# EAGLE design Backplane (EAGLE 9.2.2)
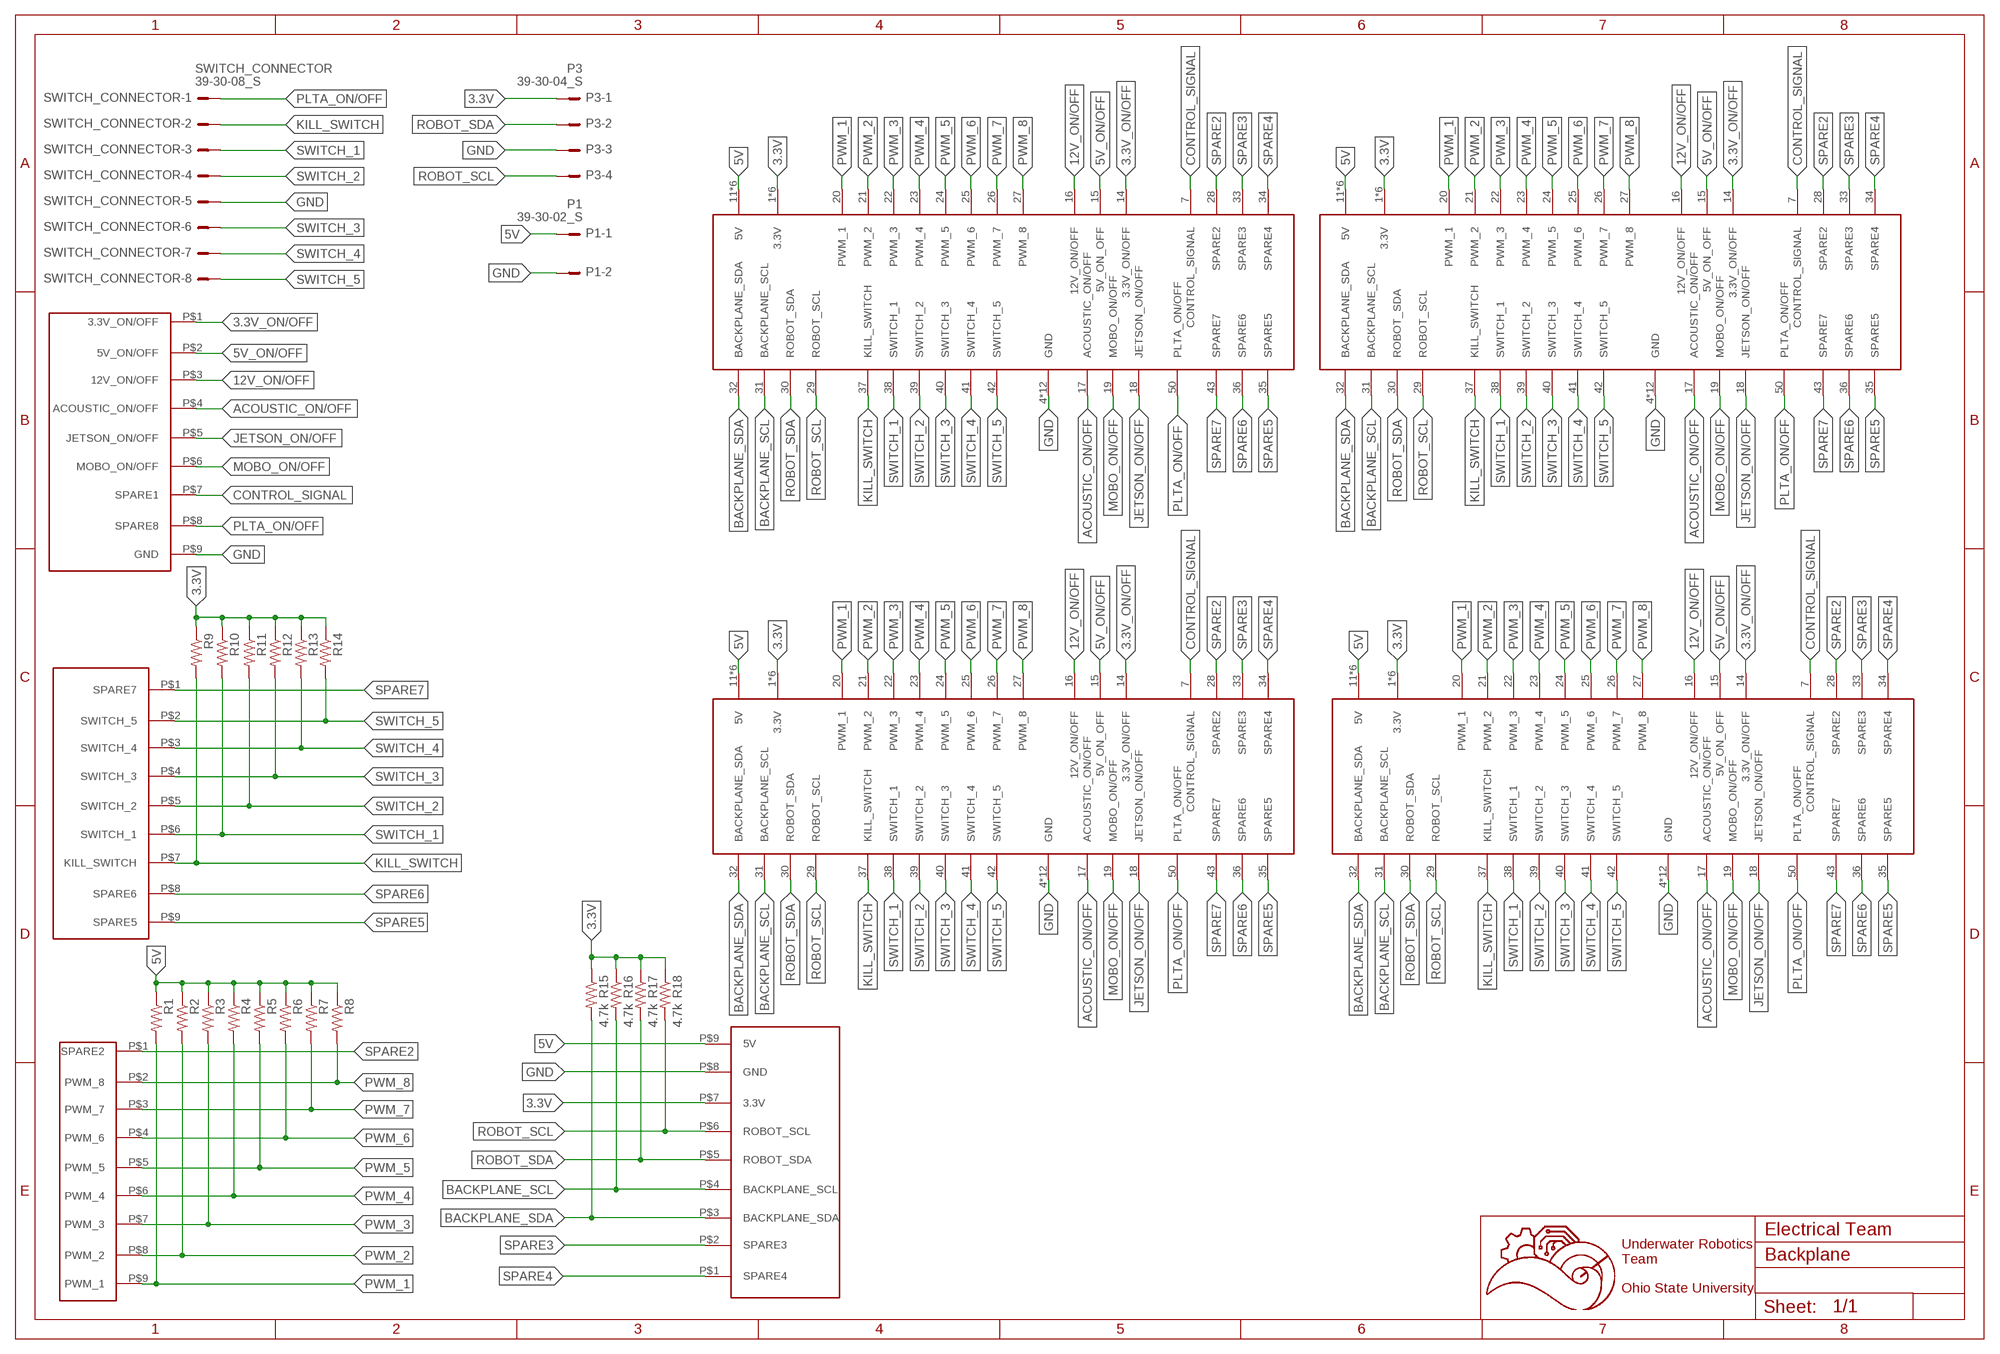
[diagram p0: schematic, sheet 1]

## Parts
P1  39-30-02_S  [39-30-?02?]
P3  39-30-04_S  [39-30-?04?]
R1  R-US_R0603  [R0603]
R2  R-US_R0603  [R0603]
R3  R-US_R0603  [R0603]
R4  R-US_R0603  [R0603]
R5  R-US_R0603  [R0603]
R6  R-US_R0603  [R0603]
R7  R-US_R0603  [R0603]
R8  R-US_R0603  [R0603]
R9  R-US_R0603  [R0603]
R10  R-US_R0603  [R0603]
R11  R-US_R0603  [R0603]
R12  R-US_R0603  [R0603]
R13  R-US_R0603  [R0603]
R14  R-US_R0603  [R0603]
R15  4.7k  R-US_R0603  [R0603]
R16  4.7k  R-US_R0603  [R0603]
R17  4.7k  R-US_R0603  [R0603]
R18  4.7k  R-US_R0603  [R0603]
SWITCH_CONNECTOR  39-30-08_S  [39-30-?08?]
U$1  5530843-FEMALE  [5530843-6-BACKPLANEMATE]
U$2  5530843-FEMALE  [5530843-6-BACKPLANEMATE]
U$3  5530843-FEMALE  [5530843-6-BACKPLANEMATE]
U$4  5530843-FEMALE  [5530843-6-BACKPLANEMATE]
U$5  929870-01-09_1  [929852-01-09_1ROW]
U$6  929870-01-09_2  [929852-01-09_1ROW]
U$7  929870-01-09_3  [929852-01-09_1ROW]
U$8  929870-01-09_4  [929852-01-09_1ROW]

## Nets
3.3V: P3.1 R9.1 R10.1 R11.1 R12.1 R13.1 R14.1 R15.1 R16.1 R17.1 R18.1 U$1.1(3.3V) U$1.2(3.3V) U$1.3(3.3V) U$1.54(3.3V) U$1.55(3.3V) U$1.56(3.3V) U$2.1(3.3V) U$2.2(3.3V) U$2.3(3.3V) U$2.54(3.3V) U$2.55(3.3V) U$2.56(3.3V) U$3.1(3.3V) U$3.2(3.3V) U$3.3(3.3V) U$3.54(3.3V) U$3.55(3.3V) U$3.56(3.3V) U$4.1(3.3V) U$4.2(3.3V) U$4.3(3.3V) U$4.54(3.3V) U$4.55(3.3V) U$4.56(3.3V) U$8.P$7(3.3V)
3.3V_ON/OFF: U$1.14(3.3V_ON/OFF) U$2.14(3.3V_ON/OFF) U$3.14(3.3V_ON/OFF) U$4.14(3.3V_ON/OFF) U$7.P$1(3.3V_ON/OFF)
5V: P1.1 R1.1 R2.1 R3.1 R4.1 R5.1 R6.1 R7.1 R8.1 U$1.11(5V) U$1.12(5V) U$1.13(5V) U$1.44(5V) U$1.45(5V) U$1.46(5V) U$2.11(5V) U$2.12(5V) U$2.13(5V) U$2.44(5V) U$2.45(5V) U$2.46(5V) U$3.11(5V) U$3.12(5V) U$3.13(5V) U$3.44(5V) U$3.45(5V) U$3.46(5V) U$4.11(5V) U$4.12(5V) U$4.13(5V) U$4.44(5V) U$4.45(5V) U$4.46(5V) U$8.P$9(5V)
5V_ON/OFF: U$1.15(5V_ON_OFF) U$2.15(5V_ON_OFF) U$3.15(5V_ON_OFF) U$4.15(5V_ON_OFF) U$7.P$2(5V_ON/OFF)
12V_ON/OFF: U$1.16(12V_ON/OFF) U$2.16(12V_ON/OFF) U$3.16(12V_ON/OFF) U$4.16(12V_ON/OFF) U$7.P$3(12V_ON/OFF)
ACOUSTIC_ON/OFF: U$1.17(ACOUSTIC_ON/OFF) U$2.17(ACOUSTIC_ON/OFF) U$3.17(ACOUSTIC_ON/OFF) U$4.17(ACOUSTIC_ON/OFF) U$7.P$4(ACOUSTIC_ON/OFF)
BACKPLANE_SCL: R16.2 U$1.31(BACKPLANE_SCL) U$2.31(BACKPLANE_SCL) U$3.31(BACKPLANE_SCL) U$4.31(BACKPLANE_SCL) U$8.P$4(BACKPLANE_SCL)
BACKPLANE_SDA: R15.2 U$1.32(BACKPLANE_SDA) U$2.32(BACKPLANE_SDA) U$3.32(BACKPLANE_SDA) U$4.32(BACKPLANE_SDA) U$8.P$3(BACKPLANE_SDA)
CONTROL_SIGNAL: U$1.7(CONTROL_SIGNAL) U$2.7(CONTROL_SIGNAL) U$3.7(CONTROL_SIGNAL) U$4.7(CONTROL_SIGNAL) U$7.P$7(SPARE1)
GND: P1.2 P3.3 SWITCH_CONNECTOR.5 U$1.4(GND) U$1.5(GND) U$1.6(GND) U$1.8(GND) U$1.9(GND) U$1.10(GND) U$1.47(GND) U$1.48(GND) U$1.49(GND) U$1.51(GND) U$1.52(GND) U$1.53(GND) U$2.4(GND) U$2.5(GND) U$2.6(GND) U$2.8(GND) U$2.9(GND) U$2.10(GND) U$2.47(GND) U$2.48(GND) U$2.49(GND) U$2.51(GND) U$2.52(GND) U$2.53(GND) U$3.4(GND) U$3.5(GND) U$3.6(GND) U$3.8(GND) U$3.9(GND) U$3.10(GND) U$3.47(GND) U$3.48(GND) U$3.49(GND) U$3.51(GND) U$3.52(GND) U$3.53(GND) U$4.4(GND) U$4.5(GND) U$4.6(GND) U$4.8(GND) U$4.9(GND) U$4.10(GND) U$4.47(GND) U$4.48(GND) U$4.49(GND) U$4.51(GND) U$4.52(GND) U$4.53(GND) U$7.P$9(GND) U$8.P$8(GND)
JETSON_ON/OFF: U$1.18(JETSON_ON/OFF) U$2.18(JETSON_ON/OFF) U$3.18(JETSON_ON/OFF) U$4.18(JETSON_ON/OFF) U$7.P$5(JETSON_ON/OFF)
KILL_SWITCH: R9.2 SWITCH_CONNECTOR.2 U$1.37(KILL_SWITCH) U$2.37(KILL_SWITCH) U$3.37(KILL_SWITCH) U$4.37(KILL_SWITCH) U$5.P$7(KILL_SWITCH)
MOBO_ON/OFF: U$1.19(MOBO_ON/OFF) U$2.19(MOBO_ON/OFF) U$3.19(MOBO_ON/OFF) U$4.19(MOBO_ON/OFF) U$7.P$6(MOBO_ON/OFF)
PLTA_ON/OFF: SWITCH_CONNECTOR.1 U$1.50(PLTA_ON/OFF) U$2.50(PLTA_ON/OFF) U$3.50(PLTA_ON/OFF) U$4.50(PLTA_ON/OFF) U$7.P$8(SPARE8)
PWM_1: R1.2 U$1.20(PWM_1) U$2.20(PWM_1) U$3.20(PWM_1) U$4.20(PWM_1) U$6.P$9(PWM_1)
PWM_2: R2.2 U$1.21(PWM_2) U$2.21(PWM_2) U$3.21(PWM_2) U$4.21(PWM_2) U$6.P$8(PWM_2)
PWM_3: R3.2 U$1.22(PWM_3) U$2.22(PWM_3) U$3.22(PWM_3) U$4.22(PWM_3) U$6.P$7(PWM_3)
PWM_4: R4.2 U$1.23(PWM_4) U$2.23(PWM_4) U$3.23(PWM_4) U$4.23(PWM_4) U$6.P$6(PWM_4)
PWM_5: R5.2 U$1.24(PWM_5) U$2.24(PWM_5) U$3.24(PWM_5) U$4.24(PWM_5) U$6.P$5(PWM_5)
PWM_6: R6.2 U$1.25(PWM_6) U$2.25(PWM_6) U$3.25(PWM_6) U$4.25(PWM_6) U$6.P$4(PWM_6)
PWM_7: R7.2 U$1.26(PWM_7) U$2.26(PWM_7) U$3.26(PWM_7) U$4.26(PWM_7) U$6.P$3(PWM_7)
PWM_8: R8.2 U$1.27(PWM_8) U$2.27(PWM_8) U$3.27(PWM_8) U$4.27(PWM_8) U$6.P$2(PWM_8)
ROBOT_SCL: P3.4 R18.2 U$1.29(ROBOT_SCL) U$2.29(ROBOT_SCL) U$3.29(ROBOT_SCL) U$4.29(ROBOT_SCL) U$8.P$6(ROBOT_SCL)
ROBOT_SDA: P3.2 R17.2 U$1.30(ROBOT_SDA) U$2.30(ROBOT_SDA) U$3.30(ROBOT_SDA) U$4.30(ROBOT_SDA) U$8.P$5(ROBOT_SDA)
SPARE2: U$1.28(SPARE2) U$2.28(SPARE2) U$3.28(SPARE2) U$4.28(SPARE2) U$6.P$1(SPARE2)
SPARE3: U$1.33(SPARE3) U$2.33(SPARE3) U$3.33(SPARE3) U$4.33(SPARE3) U$8.P$2(SPARE3)
SPARE4: U$1.34(SPARE4) U$2.34(SPARE4) U$3.34(SPARE4) U$4.34(SPARE4) U$8.P$1(SPARE4)
SPARE5: U$1.35(SPARE5) U$2.35(SPARE5) U$3.35(SPARE5) U$4.35(SPARE5) U$5.P$9(SPARE5)
SPARE6: U$1.36(SPARE6) U$2.36(SPARE6) U$3.36(SPARE6) U$4.36(SPARE6) U$5.P$8(SPARE6)
SPARE7: U$1.43(SPARE7) U$2.43(SPARE7) U$3.43(SPARE7) U$4.43(SPARE7) U$5.P$1(SPARE7)
SWITCH_1: R10.2 SWITCH_CONNECTOR.3 U$1.38(SWITCH_1) U$2.38(SWITCH_1) U$3.38(SWITCH_1) U$4.38(SWITCH_1) U$5.P$6(SWITCH_1)
SWITCH_2: R11.2 SWITCH_CONNECTOR.4 U$1.39(SWITCH_2) U$2.39(SWITCH_2) U$3.39(SWITCH_2) U$4.39(SWITCH_2) U$5.P$5(SWITCH_2)
SWITCH_3: R12.2 SWITCH_CONNECTOR.6 U$1.40(SWITCH_3) U$2.40(SWITCH_3) U$3.40(SWITCH_3) U$4.40(SWITCH_3) U$5.P$4(SWITCH_3)
SWITCH_4: R13.2 SWITCH_CONNECTOR.7 U$1.41(SWITCH_4) U$2.41(SWITCH_4) U$3.41(SWITCH_4) U$4.41(SWITCH_4) U$5.P$3(SWITCH_4)
SWITCH_5: R14.2 SWITCH_CONNECTOR.8 U$1.42(SWITCH_5) U$2.42(SWITCH_5) U$3.42(SWITCH_5) U$4.42(SWITCH_5) U$5.P$2(SWITCH_5)

## Notes on the sheet
- Electrical Team
- Underwater Robotics
  Team
  
  Ohio State University

## Library data of the parts
P1 = con-molex-mini-fit:39-30-?02?_S: HEADER
P3 = con-molex-mini-fit:39-30-?04?_S: HEADER
R1-R18 = rcl:R-US_: RESISTOR, American symbol; SPICEPREFIX: R
SWITCH_CONNECTOR = con-molex-mini-fit:39-30-?08?_S: HEADER
U$1-U$4 = 5530843-6:5530843-FEMALE
U$5 = 3M_929852_Connector:929870-01-09_1
U$6 = 3M_929852_Connector:929870-01-09_2
U$7 = 3M_929852_Connector:929870-01-09_3
U$8 = 3M_929852_Connector:929870-01-09_4

## Board
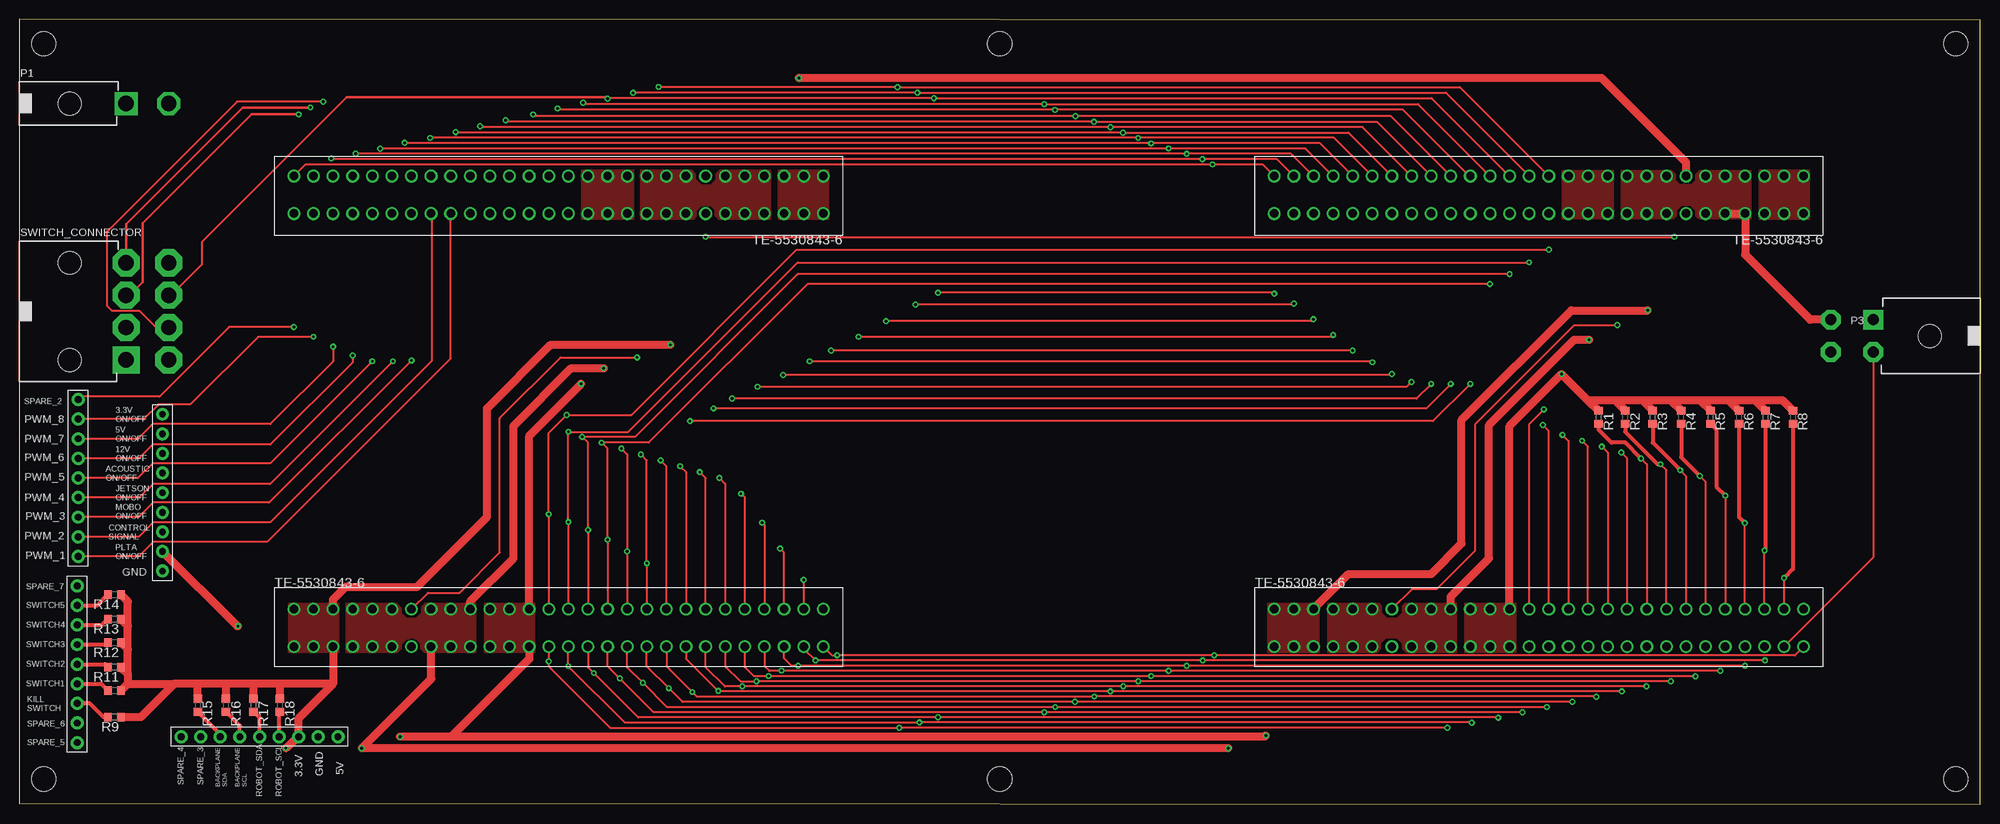
[diagram p1: board, top side]
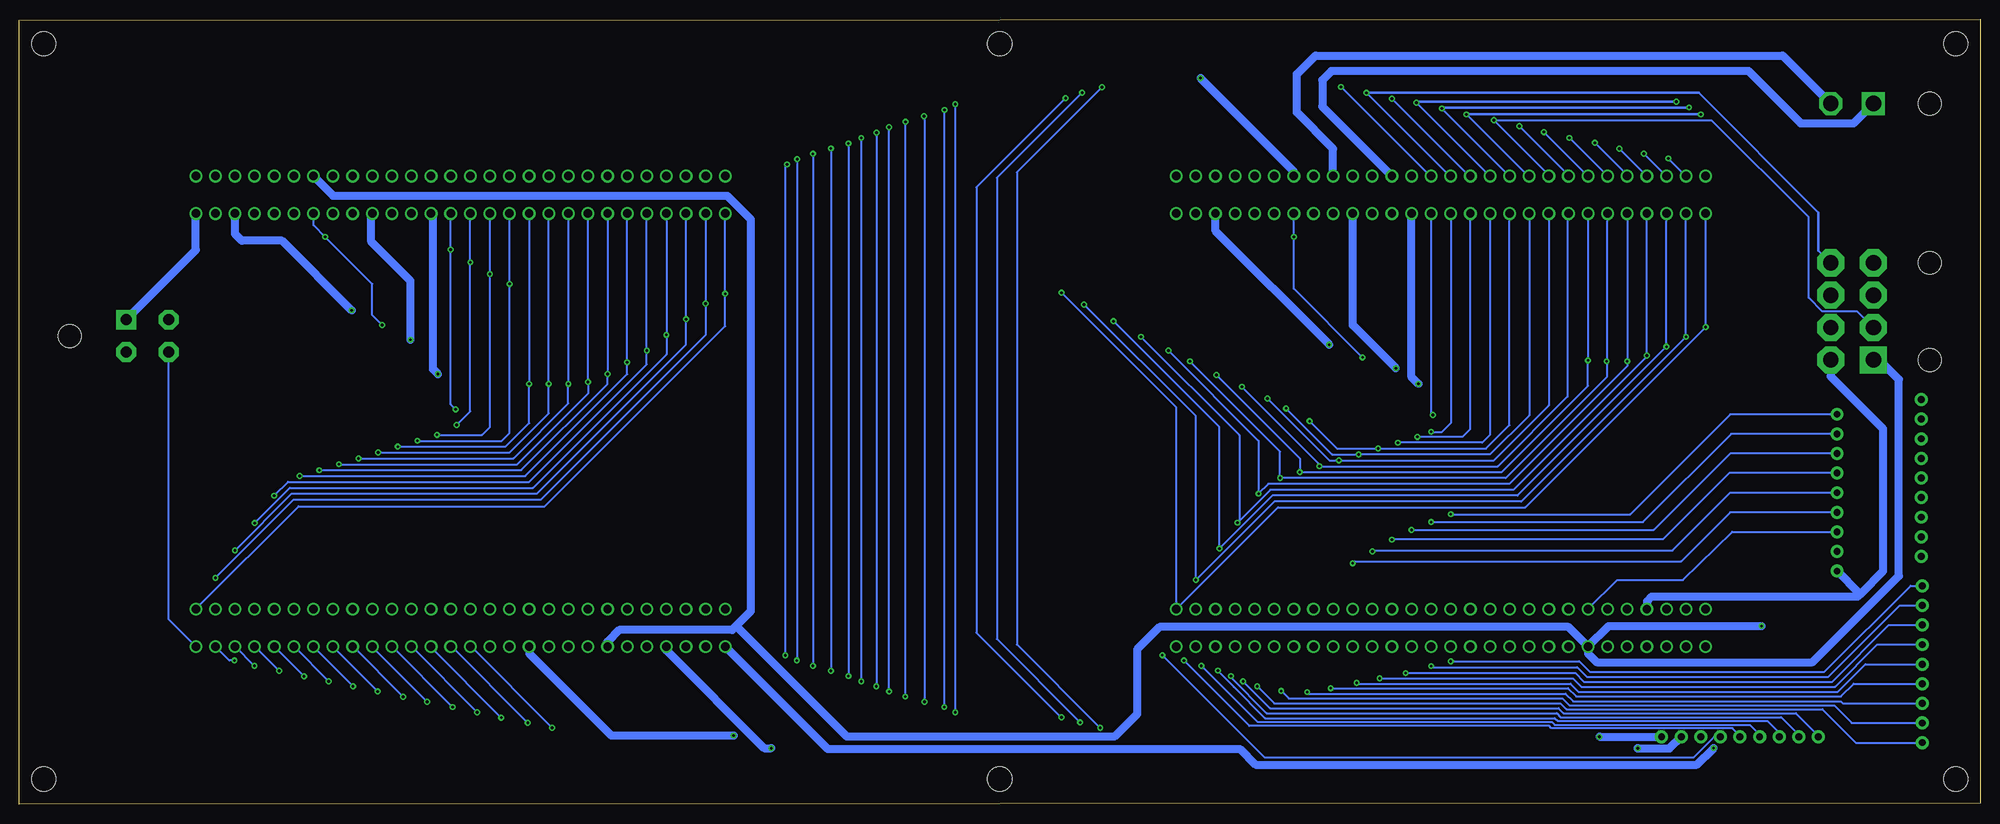
[diagram p2: board, bottom side, seen from below]

Size 254 x 101.73 mm. Coordinates in mm from the lower left corner, seen from the top.
Outline: 0,0.13 254,0 254,101.6 0,101.73 0,0.13
Copper layers (1*16): Top 0.035mm / dielectric 1.5mm / Bottom 0.035mm
Design rules "default": minimum track width 6mil, minimum drill 0.35mm, track to track 6mil, track to pad 6mil, pad to pad 6mil, via to via 6mil, smd to smd 6mil, copper to edge 40mil, drill to drill 6mil, minimum pad ring 10mil, minimum via ring 8mil, stop-mask expansion 4mil, vias tented up to drill 0mil, thermal gap 10mil
Holes 3.17 mm at 3.17,98.55 3.17,3.3 250.82,3.3 250.82,98.55 127,3.3 127,98.55

### Footprints (pad centres in the part's own frame; a part is rotated, then mirrored left to right if it is on the bottom)
39-30-?02? = drill 2 pad 3 square: 1 0,0 | drill 2 pad 3 octagon: 2 0,5.512 | hole 3: 0,-7.3
39-30-?04? = drill 1.422 pad 2.54 square: 1 2.095,0 | drill 1.422 pad 2.54 octagon: 2 -2.095,0; 3 2.095,5.512; 4 -2.095,5.512 | hole 3: 0,-7.3
R0603 = smd 1 x 1.1: 1 -0.85,0; 2 0.85,0
39-30-?08? = drill 2 pad 3.5 square: 1 6.287,0 | drill 2 pad 3.5 octagon: 2 2.095,0; 3 -2.095,0; 4 -6.287,0; 5 6.287,5.512; 6 2.095,5.512; 7 -2.095,5.512; 8 -6.287,5.512 | hole 3: -6.287,-7.3; 6.287,-7.3
5530843-6-BACKPLANEMATE = drill 1.092: 1 0,4.851; 2 2.54,4.851; 3 5.08,4.851; 4 7.62,4.851; 5 10.16,4.851; 6 12.7,4.851; 7 15.24,4.851; 8 17.78,4.851; 9 20.32,4.851; 10 22.86,4.851; 11 25.4,4.851; 12 27.94,4.851; 13 30.48,4.851; 14 33.02,4.851; 15 35.56,4.851; 16 38.1,4.851; 17 40.64,4.851; 18 43.18,4.851; 19 45.72,4.851; 20 48.26,4.851; 21 50.8,4.851; 22 53.34,4.851; 23 55.88,4.851; 24 58.42,4.851; 25 60.96,4.851; 26 63.5,4.851; 27 66.04,4.851; 28 68.58,4.851; 29 68.58,0; 30 66.04,0; 31 63.5,0; 32 60.96,0; 33 58.42,0; 34 55.88,0; 35 53.34,0; 36 50.8,0; 37 48.26,0; 38 45.72,0; 39 43.18,0; 40 40.64,0; 41 38.1,0; 42 35.56,0; 43 33.02,0; 44 30.48,0; 45 27.94,0; 46 25.4,0; 47 22.86,0; 48 20.32,0; 49 17.78,0; 50 15.24,0; 51 12.7,0; 52 10.16,0; 53 7.62,0; 54 5.08,0; 55 2.54,0; 56 0,0
929852-01-09_1ROW = drill 0.889 pad 1.676: P$1 1.27,1.27; P$2 3.81,1.27; P$3 6.35,1.27; P$4 8.89,1.27; P$5 11.43,1.27; P$6 13.97,1.27; P$7 16.51,1.27; P$8 19.05,1.27; P$9 21.59,1.27

### Placement (x,y rotation side)
P1  39-30-02?_S  [39-30-?02?]  13.84,90.8 270 top
P3  39-30-04?_S  [39-30-?04?]  240.16,60.71 90 top
R1  10k  [R0603]  204.6,50.16 270 top
R2  10k  [R0603]  208.03,50.16 270 top
R3  10k  [R0603]  211.58,50.16 270 top
R4  10k  [R0603]  215.26,50.16 270 top
R5  10k  [R0603]  219.07,50.16 270 top
R6  10k  [R0603]  222.76,50.16 270 top
R7  10k  [R0603]  226.19,50.16 270 top
R8  10k  [R0603]  229.74,50.16 270 top
R9  10k  [R0603]  12.32,11.3 180 top
R10  10k  [R0603]  12.32,14.73 180 top
R11  10k  [R0603]  12.32,17.78 180 top
R12  10k  [R0603]  12.32,20.95 180 top
R13  10k  [R0603]  12.32,24 180 top
R14  10k  [R0603]  12.32,27.18 180 top
R15  23.11,12.83 270 top
R16  26.8,12.83 270 top
R17  30.35,12.83 270 top
R18  33.78,12.83 270 top
SWITCH_CONNECTOR  39-30-08?_S  [39-30-?08?]  13.84,63.88 270 top
U$1  104.14,81.41 180 top
U$2  231.14,81.41 180 top
U$3  35.56,20.45 0 top
U$4  162.56,20.45 0 top
U$5  6.22,29.59 270 top
U$6  6.35,53.72 270 top
U$7  17.27,51.82 270 top
U$8  19.68,7.49 0 top

### Tracks (layer width: path | path; a pad name or v marks a point on that pad's centre or on a via)
3.3V  (via drill 0.35)
  Top 1.016: U$3.54 40.64,15.62 | 40.64,15.62 36.2,11.18 U$8.P$7 36.2,8.64 35.9,8.64 34.55,7.29 v34.52,7.29 | U$4.3 172.19,29.84 182.88,29.84 186.82,33.78 186.82,49.78 201.04,64.01 v210.95,64.01 | U$3.3 40.64,26.54 42.29,28.19 51.56,28.19 60.58,37.21 60.58,51.31 68.83,59.56 v84.33,59.56 | 40.64,15.62 33.91,15.62 | 33.91,15.62 30.35,15.62 | 30.35,15.62 26.8,15.62 | 26.8,15.62 23.11,15.62 | 23.11,15.62 20.07,15.62 | 20.07,15.62 15.75,11.3 R9.1 | R15.1 23.11,15.62 | R16.1 26.8,15.62 | R17.1 30.35,15.62 | R18.1 33.78,15.49 33.91,15.62 | R10.1 14.06,15.62 | 14.06,15.62 20.07,15.62 | R11.1 14.06,16.89 | 14.06,16.89 14.06,15.62 | 14.06,16.89 14.06,20.07 | 14.06,20.07 R12.1 | 14.06,20.07 14.06,23.11 | 14.06,23.11 R13.1 | 14.06,23.11 14.06,26.29 R14.1
  Bottom 1.016: P3.1 231.1,71.86 231.14,71.86 U$2.1 | U$4.56 149.3,7.19 95.91,7.19 93.85,5.13 36.68,5.13 v34.52,7.29 | v210.95,64.01 219.96,73.02 225.17,73.02 226.06,73.91 U$2.3 | v84.33,59.56 99.06,74.3 U$1.3
  pour Top (no thermals): 34.8,26.04 34.8,19.68 41.4,19.68 41.4,26.04
  pour Top (no thermals): 98.3,82.17 98.3,75.82 104.9,75.82 104.9,82.17
  pour Top (no thermals): 225.3,82.17 225.3,75.82 231.9,75.82 231.9,82.17
  pour Top (no thermals): 161.67,26.04 161.67,19.68 168.4,19.68 168.4,26.04
3.3V_ON/OFF  (via drill 0.35)
  Top 0.254: U$3.14 v68.58,37.59 68.58,48.13 v70.9,50.45 79.28,50.45 100.71,71.88 v198.12,71.88 | U$4.14 195.58,49.28 v197.49,51.18
  Bottom 0.254: v68.58,37.59 45.34,37.59 32.38,50.55 U$7.P$1 | v70.9,50.45 71.12,50.67 U$1.14 | v197.49,51.18 198.12,51.82 v198.12,71.88 U$2.14
5V  (via drill 0.35)
  Top 1.016: U$3.44 66.04,18.85 55.96,8.76 | v161.47,8.92 161.31,8.76 55.96,8.76 | 55.96,8.76 v49.33,8.76 | U$4.13 193.04,49.02 v199.77,55.75 203.14,52.39 | U$3.13 66.04,47.75 v72.77,54.48 | 203.14,52.39 204.51,51.02 R1.1 | 203.14,52.39 206.65,52.39 | 206.65,52.39 R2.1 | 206.65,52.39 210.21,52.39 | 210.21,52.39 R3.1 | 210.21,52.39 213.89,52.39 | 213.89,52.39 R4.1 | 213.89,52.39 217.7,52.39 | 217.7,52.39 R5.1 | 217.7,52.39 221.39,52.39 | 221.39,52.39 R6.1 | 221.39,52.39 224.81,52.39 | 224.81,52.39 R7.1 | 224.81,52.39 228.37,52.39 R8.1
  Bottom 1.016: U$4.46 187.96,19.56 177.32,8.92 v161.47,8.92 | v199.77,55.75 200.41,56.39 200.41,76.3 U$2.13 | v72.77,54.48 73.66,55.37 U$1.13 | v49.33,8.76 U$8.P$9 | U$1.45 85.22,90.42 85.22,93.85 84.05,95.02 30,95.02 23.24,88.27 16.38,88.27 P1.1
  pour Top (no thermals): 60.2,26.04 60.2,19.68 66.8,19.68 66.8,26.04
  pour Top (no thermals): 72.77,82.17 72.77,75.82 79.63,75.82 79.63,82.17
  pour Top (no thermals): 206.5,82.17 206.5,75.82 199.9,75.82 199.9,82.17
  pour Top (no thermals): 187.2,26.04 187.2,19.68 193.93,19.68 193.93,26.04
5V_ON/OFF  (via drill 0.35)
  Top 0.254: U$3.15 v71.12,36.58 v71.12,48.28 78.89,48.28 100.84,70.23 v195.58,70.23 | U$4.15 198.12,48.39 v197.36,49.15
  Bottom 0.254: v71.12,48.28 69.7,48.28 68.58,49.4 U$1.15 | v197.36,49.15 195.58,50.93 v195.58,70.23 U$2.15 | U$7.P$2 32.26,48.01 43.69,36.58 v71.12,36.58
12V_ON/OFF  (via drill 0.35)
  Top 0.254: v199.9,47.88 200.66,47.12 U$4.16 | v193.04,68.71 100.84,68.71 79.76,47.62 v72.9,47.62 73.66,46.86 v73.66,35.56 U$3.16
  Bottom 0.254: v199.9,47.88 194.06,47.88 193.04,48.9 v193.04,68.71 U$2.16 | v72.9,47.62 67.06,47.62 66.04,48.64 U$1.16 | U$7.P$3 32.38,45.47 42.29,35.56 v73.66,35.56
ACOUSTIC_ON/OFF  (via drill 0.35)
  Top 0.254: v202.44,47.12 203.2,46.36 U$4.17 | v190.5,67.44 102.11,67.44 81.53,46.86 v75.44,46.86 76.2,46.1 v76.2,34.29 U$3.17
  Bottom 0.254: v202.44,47.12 191.52,47.12 190.5,48.13 v190.5,67.44 U$2.17 | v75.44,46.86 64.52,46.86 63.5,47.88 U$1.17 | v76.2,34.29 76.07,34.42 41.02,34.42 32.51,42.93 U$7.P$4
BACKPLANE_SCL  (via drill 0.35)
  Top 0.254: U$3.31 99.06,18.92 100.03,17.96 v100.89,17.96 151.16,17.96 v151.21,17.96 151.26,17.96 v223.54,17.96 | U$2.31 164.74,84.3 v151.21,84.3 43.59,84.3 v43.56,84.33
  Top 0.508: U$8.P$4 28.57,10.2 R16.2
  Bottom 0.254: U$4.31 226.03,20.45 v223.54,17.96 | v43.56,84.33 U$1.31 | v151.21,84.3 v151.21,17.96 | v100.89,17.96 93.6,10.67 55.5,10.67 55.12,10.29 29.84,10.29 28.57,9.02 U$8.P$4
BACKPLANE_SDA  (via drill 0.35)
  Top 0.254: U$3.32 96.52,17.91 97.16,17.27 98.68,17.27 v98.73,17.32 98.75,17.3 v148.87,17.3 v220.34,17.3 | U$2.32 166.6,84.99 v148.87,84.99 46.76,84.99 v46.74,84.96
  Top 0.508: U$8.P$3 26.04,9.06 R15.2
  Bottom 0.254: U$4.32 223.5,20.45 v220.34,17.3 | v46.74,84.96 U$1.32 | v148.87,84.99 v148.87,17.3 | v98.73,17.32 98.73,17.28 96.67,15.22 92.63,11.18 55.12,11.18 54.74,10.79 27.56,10.79 26.04,9.27 U$8.P$3
CONTROL_SIGNAL  (via drill 0.35)
  Top 0.254: U$4.7 180.44,27.94 183.64,27.94 188.59,32.89 188.59,49.28 201.42,62.1 v207.01,62.1 | U$3.7 52.93,27.43 57.02,27.43 62.23,32.64 62.23,50.04 70.1,57.91 v80.01,57.91 | v88.9,73.53 v214.38,73.53
  Bottom 0.254: U$7.P$7 32.13,35.31 38.51,29.08 47.02,29.08 U$3.7 | v207.01,62.1 208.28,63.37 208.28,67.44 v214.38,73.53 215.9,75.06 U$2.7 | v80.01,57.91 88.9,66.8 v88.9,73.53 U$1.7
GND  (via drill 0.35)
  Top 0.254: 214.12,76.58 214.1,76.56
  Top 1.016: P3.3 231.98,62.8 223.57,71.21 223.57,76.5 U$2.4 U$2.5 | v156.59,7.26 v44.35,7.26 53.37,16.28 53.37,20.42 U$3.49 | U$4.10 185.42,26.92 190.37,31.88 190.37,49.15 201.42,60.2 v203.33,60.2 | U$3.10 58.42,26.29 64.01,31.88 64.01,49.02 71.5,56.52 v75.69,56.52
  Bottom 1.016: SWITCH_CONNECTOR.5 19.38,57.57 19.38,55.45 12.57,48.64 12.57,30.23 15.37,27.43 | 15.37,27.43 15.75,27.43 U$7.P$9 | 15.37,27.43 15.88,26.92 42.57,26.92 43.18,26.31 U$3.4 | U$4.53 170.18,19.94 157.5,7.26 v156.59,7.26 | v203.33,60.2 203.33,67.82 208.41,72.9 208.41,76.43 U$2.10 | v75.69,56.52 81.28,62.1 U$1.10 | U$8.P$8 40.26,7.24 44.35,7.24 v44.35,7.26 | U$1.48 83.82,84.96 88.52,89.66 88.52,94.61 86.11,97.03 25.58,97.03 P1.2
  pour Top (no thermals): 42.29,26.04 42.29,19.68 49.02,19.68 49.53,20.19 49.53,20.83 50.16,21.46 51.44,21.46 51.94,20.95 51.94,20.19 52.45,19.68 59.18,19.68 59.18,26.04 52.58,26.04 52.07,25.53 52.07,24.77 51.44,24.13 50.16,24.13 49.53,24.77 49.53,25.4 48.9,26.04
  pour Top (no thermals): 80.39,82.17 80.39,75.82 87.38,75.82 87.76,76.2 87.76,76.96 88.39,77.6 89.53,77.6 90.04,77.09 90.04,76.33 90.55,75.82 97.41,75.82 97.41,82.17 90.68,82.17 90.17,81.66 90.17,80.9 89.53,80.26 88.39,80.26 87.63,81.03 87.63,81.66 87.12,82.17
  pour Top (no thermals): 224.28,82.17 224.28,75.82 217.55,75.82 217.17,76.2 217.17,76.96 216.53,77.6 215.26,77.6 214.63,76.96 214.63,76.2 214.25,75.82 207.52,75.82 207.52,82.17 214,82.17 214.5,81.66 214.5,80.9 215.01,80.39 216.66,80.39 217.17,80.9 217.17,81.66 217.68,82.17
  pour Top (no thermals): 169.42,26.04 169.42,19.68 175.9,19.68 176.4,20.19 176.4,20.95 177.04,21.59 178.44,21.59 179.07,20.95 179.07,20.19 179.58,19.68 186.18,19.68 186.18,26.04 179.45,26.04 179.07,25.65 179.07,24.77 178.44,24.13 177.16,24.13 176.53,24.77 176.53,25.65 176.15,26.04
JETSON_ON/OFF  (via drill 0.35)
  Top 0.254: v204.98,46.36 205.74,45.59 U$4.18 | v77.98,46.1 78.74,45.34 v78.74,32.77 U$3.18 | v187.96,54.48 183.13,49.66 v86.87,49.66
  Bottom 0.254: v204.98,46.36 191.01,46.36 187.96,49.4 v187.96,54.48 U$2.18 | v86.87,49.66 83.31,46.1 v77.98,46.1 64.01,46.1 60.96,49.15 U$1.18 | v78.74,32.77 78.61,32.89 39.88,32.89 32.38,40.39 U$7.P$5
KILL_SWITCH  (via drill 0.35)
  Top 0.254: v204.27,13.95 204.24,13.97 v139.24,13.97 87.76,13.97 v87.19,14.54 83.82,17.91 U$3.37 | v62.99,88.65 63.2,88.44 v139.22,88.44 175.84,88.44 U$2.37 | R9.2 10.92,11.3
  Top 0.508: 10.92,11.3 9.14,13.08 8.38,13.08 | 8.38,13.08 U$5.P$7 | 8.38,13.08
  Bottom 0.254: v139.22,88.44 139.24,88.42 v139.24,13.97 | U$4.37 210.77,20.45 v204.27,13.95 | U$1.37 55.88,81.53 v62.99,88.65 34.8,88.65 22.23,76.07 22.23,65.66 20.45,63.88 15.94,63.88 SWITCH_CONNECTOR.2 | v87.19,14.54 87,14.35 53.72,14.35 52.7,13.34 18.03,13.34 17.78,13.08 U$5.P$7
MOBO_ON/OFF  (via drill 0.35)
  Top 0.254: v207.52,45.59 208.28,44.83 U$4.19 | v80.52,45.34 81.28,44.58 v81.28,31.24 U$3.19 | v185.42,54.48 182.25,51.31 v89.92,51.31
  Bottom 0.254: v207.52,45.59 190.5,45.59 185.42,50.67 v185.42,54.48 U$2.19 | v89.92,51.31 83.95,45.34 v80.52,45.34 63.5,45.34 58.42,50.42 U$1.19 | v81.28,31.24 81.03,31.5 38.73,31.5 32.38,37.85 U$7.P$6
PLTA_ON/OFF  (via drill 0.35)
  Top 1.016: v100.99,94.11 204.98,94.11 215.9,83.19 U$2.50 | v28.32,23.11 28.19,23.11 U$7.P$8
  Bottom 1.016: U$3.50 50.8,19.56 49.66,18.41 21.72,18.41 10.54,29.59 10.54,55.05 13.08,57.6 SWITCH_CONNECTOR.1 | v100.99,94.11 88.9,82.02 U$1.50 | U$2.50 213.36,78.87 162.31,78.87 159.26,75.82 159.26,25.02 161.15,23.13 | U$4.50 177.8,21.08 176.28,22.61 161.67,22.61 161.15,23.13 | U$3.50 53.34,22.99 106.3,22.99 109.22,20.07 109.22,11.68 112.14,8.76 146.79,8.76 161.15,23.13 | v28.32,23.11 48.13,23.11 U$3.50
PWM_1  (via drill 0.35)
  Top 0.254: v210.06,44.83 210.82,44.07 U$4.20 | v83.06,44.58 83.82,43.82 U$3.20 | v182.88,54.48 180.97,52.58 v92.33,52.58 | U$6.P$9 15.44,32.13 17.32,34.01 32.11,34.01 55.88,57.79 U$1.20
  Top 0.508: v210.06,44.83 208.03,46.86 206.25,46.86 204.6,48.51 R1.2
  Bottom 0.254: v210.06,44.83 189.99,44.83 182.88,51.94 v182.88,54.48 U$2.20 | v92.33,52.58 84.33,44.58 v83.06,44.58 62.99,44.58 55.88,51.69 U$1.20
PWM_2  (via drill 0.35)
  Top 0.254: v212.6,44.07 213.36,43.31 U$4.21 | v85.6,43.82 86.36,43.05 U$3.21 | v180.34,54.74 179.71,54.1 v95.63,54.1 | U$6.P$8 15.44,34.67 17.32,36.55 32.49,36.55 53.47,57.53 53.47,76.43 U$1.21
  Top 0.508: R2.2 208.03,48.26 212.22,44.07 v212.6,44.07
  Bottom 0.254: v212.6,44.07 189.48,44.07 180.34,53.21 v180.34,54.74 U$2.21 | v95.63,54.1 85.6,44.07 v85.6,43.82 62.48,43.82 53.47,52.83 53.47,76.43 U$1.21
PWM_3  (via drill 0.35)
  Top 0.254: v215.14,43.31 215.9,42.55 U$4.22 | v88.14,43.05 88.9,42.29 U$3.22 | v177.8,55.75 177.67,55.63 v98.93,55.63 | v50.8,57.53 32.36,39.09 17.32,39.09 15.44,37.21 U$6.P$7
  Top 0.508: v215.14,43.31 211.58,46.86 R3.2
  Bottom 0.254: v215.14,43.31 188.98,43.31 177.8,54.48 v177.8,55.75 U$2.22 | v98.93,55.63 88.14,44.83 v88.14,43.05 61.98,43.05 50.8,54.23 v50.8,57.53 U$1.22
PWM_4  (via drill 0.35)
  Top 0.254: v217.68,42.55 218.44,41.78 U$4.23 | v90.68,42.29 91.44,41.53 U$3.23 | v175.26,57.28 175.13,57.4 v102.36,57.4 | v48.39,57.4 32.49,41.5 17.32,41.5 15.56,39.75 U$6.P$6
  Top 0.508: R4.2 215.26,44.96 v217.68,42.55
  Bottom 0.254: v217.68,42.55 188.47,42.55 175.26,55.75 v175.26,57.28 U$2.23 | v102.36,57.4 90.68,45.72 v90.68,42.29 61.47,42.29 48.39,55.37 v48.39,57.4 48.39,76.43 U$1.23
PWM_5  (via drill 0.35)
  Top 0.254: v93.47,40.26 93.98,39.75 U$3.24 | v172.72,58.8 v105.16,58.8 | U$6.P$5 15.37,42.29 17.27,44.2 32.51,44.2 v45.72,57.4 | v220.98,40.01 U$4.24
  Top 0.508: R5.2 219.84,48.55 219.84,41.15 v220.98,40.01
  Bottom 0.254: v220.98,40.01 219.2,41.78 187.96,41.78 172.72,57.02 v172.72,58.8 U$2.24 | v93.47,40.26 92.2,41.53 60.96,41.53 45.72,56.77 v45.72,57.4 U$1.24 | v105.16,58.8 93.47,47.12 v93.47,40.26 | v93.47,40.26
PWM_6  (via drill 0.35)
  Top 0.254: v96.22,36.49 96.52,36.2 U$3.25 | v170.18,60.83 169.93,60.58 v108.71,60.58 | U$6.P$4 15.49,44.83 17.27,46.61 32.51,46.61 43.18,57.28 v43.18,58.17 | U$4.25 v223.52,36.45
  Top 0.508: R6.2 222.76,37.21 v223.52,36.45
  Bottom 0.254: v223.52,36.45 218.95,41.02 187.45,41.02 170.18,58.29 v170.18,60.83 U$2.25 | v108.71,60.58 95.97,47.84 95.97,36.75 v96.22,36.49 91.95,40.77 60.45,40.77 43.18,58.04 v43.18,58.17 U$1.25
PWM_7  (via drill 0.35)
  Top 0.254: v98.55,33.15 99.06,32.64 U$3.26 | v167.64,62.87 167.39,62.61 v112.27,62.61 | U$4.26 v226.06,32.89 | v40.64,59.31 40.64,57.4 32.51,49.28 17.27,49.28 15.37,47.37 U$6.P$3
  Top 0.508: R7.2 226.19,33.02 v226.06,32.89
  Bottom 0.254: v226.06,32.89 218.69,40.26 186.94,40.26 167.64,59.56 v167.64,62.87 U$2.26 | v112.27,62.61 98.55,48.9 v98.55,33.15 91.69,40.01 59.94,40.01 v40.64,59.31 U$1.26
PWM_8  (via drill 0.35)
  Top 0.254: v165.1,64.9 164.97,64.77 v116.08,64.77 | v101.6,29.08 U$3.27 | U$4.27 v228.6,29.34 | U$6.P$2 16.13,49.91 18.03,51.82 22.16,51.82 30.93,60.58 v38.1,60.58
  Top 0.508: R8.2 229.74,30.48 v228.6,29.34
  Bottom 0.254: v228.6,29.34 218.44,39.5 186.44,39.5 165.1,60.83 v165.1,64.9 U$2.27 | v116.08,64.77 101.6,50.29 v101.6,29.08 91.44,39.24 59.44,39.24 v38.1,60.58 U$1.27
ROBOT_SCL  (via drill 0.35, 0.35 pad 0.55)
  Top 0.254: U$4.29 230,19.3 v154.79,19.3 105.97,19.3 v105.94,19.33 105.26,19.33 U$3.29 | U$1.29 37.08,82.93 v154.56,82.93 161.04,82.93 U$2.29 | 33.66,11.85 R18.2
  Top 0.508: U$8.P$6 33.66,11.85
  Bottom 0.254: P3.4 234.65,23.95 U$4.29 | v154.56,82.93 154.79,82.7 v154.79,19.3 | v105.94,19.33 92.71,6.1 37.11,6.1 34.44,8.76 U$8.P$6
ROBOT_SDA  (via drill 0.35)
  Top 0.254: P3.2 240.16,32 U$4.30 | U$3.30 101.6,20.17 103.13,18.64 v103.15,18.64 103.15,18.57 103.22,18.64 v153.29,18.64 153.36,18.64 v226.14,18.64 | U$2.30 162.92,83.59 v153.24,83.59 40.49,83.59 v40.39,83.69
  Top 0.508: U$8.P$5 31.11,11.21 R17.2
  Bottom 0.254: v40.39,83.69 U$1.30 | v153.24,83.59 153.24,18.69 v153.29,18.64 | v103.15,18.64 94.67,10.16 55.81,10.16 55.53,9.88 32.11,9.88 31.11,8.89 U$8.P$5 | v226.14,18.64 226.8,18.64 U$4.30
SPARE2  (via drill 0.35)
  Top 0.254: v35.56,61.85 27.18,61.85 18.16,52.83 8,52.83 U$6.P$1 | v119,66.29 162.43,66.29 v162.56,66.17
  Bottom 0.254: U$1.28 v35.56,61.85 58.93,38.48 90.96,38.48 U$3.28 104.14,51.44 v119,66.29 | U$4.28 217.83,38.61 185.93,38.61 162.56,61.98 v162.56,66.17 U$2.28
SPARE3  (via drill 0.35)
  Top 0.254: v217.12,16.59 217.09,16.61 v146.61,16.61 v97.05,16.61 95.15,16.61 93.98,17.78 U$3.33 | U$2.33 168.48,85.65 v146.61,85.65 49.99,85.65 v49.91,85.72
  Bottom 0.254: U$4.33 v217.12,16.59 | v49.91,85.72 45.72,81.53 U$1.33 | v146.61,85.65 v146.61,16.61 | v97.05,16.61 97.08,16.59 97.08,16.46 92.43,11.81 54.86,11.81 54.36,11.3 25.78,11.3 23.5,9.02 U$8.P$2
SPARE4  (via drill 0.35)
  Top 0.254: U$3.34 91.44,17.91 93.4,15.95 v95.48,15.95 v144.93,15.95 v213.92,15.95 | U$2.34 170.31,86.36 v144.93,86.36 v53.21,86.36
  Bottom 0.254: U$4.34 218.41,20.45 v213.92,15.95 | v53.21,86.36 U$1.34 | v144.93,15.95 v144.93,86.36 | v95.48,15.95 91.97,12.45 54.61,12.45 53.98,11.81 23.88,11.81 20.95,8.89 U$8.P$1
SPARE5  (via drill 0.35)
  Top 0.254: v210.77,15.29 v143,15.29 v93.65,15.29 91.39,15.29 88.9,17.78 U$3.35 | v56.52,87.12 56.59,87.05 v142.95,87.05 172.16,87.05 U$2.35
  Bottom 0.254: U$4.35 215.9,20.42 v210.77,15.29 | U$1.35 v56.52,87.12 | v142.95,87.05 142.95,15.34 v143,15.29 | v93.65,15.29 91.44,13.08 54.36,13.08 53.59,12.32 20.45,12.32 16.13,8 U$5.P$9
SPARE6  (via drill 0.35)
  Top 0.254: U$3.36 86.36,18.87 v90.54,14.69 90.6,14.63 v141.33,14.63 v207.57,14.63 | U$2.36 173.99,87.76 v141.35,87.76 59.82,87.76 v59.69,87.88
  Bottom 0.254: U$4.36 213.36,20.42 v207.57,14.63 | v59.69,87.88 53.34,81.53 U$1.36 | v141.33,14.63 141.33,87.73 v141.35,87.76 | v90.54,14.69 89.56,13.72 54.1,13.72 53.21,12.83 18.92,12.83 16.64,10.54 U$5.P$8
SPARE7  (via drill 0.35)
  Top 0.254: U$3.43 v68.58,18.54 68.58,17.91 76.56,9.93 v114,9.93 v184.99,9.93 | v82.8,92.96 82.83,92.94 v113.77,92.94 186.59,92.94 U$2.43
  Bottom 0.254: U$4.43 195.5,20.45 v184.99,9.93 | v82.8,92.96 71.25,81.41 U$1.43 | v113.77,92.94 124.79,81.91 124.79,20.73 v114,9.93 | v68.58,18.54 51.94,18.54 50.55,17.14 20.2,17.14 9.02,28.32 U$5.P$1
SWITCH_1  (via drill 0.35)
  Top 0.254: v66.55,89.41 66.78,89.18 v136.8,89.18 177.65,89.18 U$2.38 | v201.17,13.28 v136.75,13.28 85.9,13.28 v84.14,15.05 81.28,17.91 U$3.38
  Top 0.305: v36.2,89.41 30.1,89.41 16,75.31 16,67.69 14.29,65.98 SWITCH_CONNECTOR.3
  Top 0.508: U$5.P$6 10.58,15.62 R10.2
  Bottom 0.254: v136.8,89.18 136.75,89.18 v136.75,13.28 | U$4.38 208.28,20.4 v201.17,13.28 | v66.55,89.41 58.55,81.41 U$1.38 | v84.14,15.05 53.4,15.05 52.32,13.97 18.03,13.97 16.38,15.62 U$5.P$6
  Bottom 0.305: v66.55,89.41 v36.2,89.41
SWITCH_2  (via drill 0.35)
  Top 0.254: v69.72,90.17 69.9,89.99 v134.16,89.99 179.25,89.99 187.83,81.41 U$2.39 | v197.87,12.6 v134.19,12.6 83.92,12.6 v80.77,15.75 78.74,17.78 U$3.39
  Top 0.305: v37.72,90.3 28.96,90.3 13.84,75.18 SWITCH_CONNECTOR.4
  Top 0.508: U$5.P$5 11.09,18.16 R11.2
  Bottom 0.254: v134.16,89.99 134.19,89.97 v134.19,12.6 | U$4.39 205.72,20.45 v197.87,12.6 | U$1.39 v69.72,90.17 | v80.77,15.75 80.64,15.62 53.09,15.62 52.07,14.61 18.41,14.61 14.86,18.16 U$5.P$5
  Bottom 0.305: v69.72,90.17 69.6,90.3 v37.72,90.3
SWITCH_3  (via drill 0.35)
  Top 0.254: v194.69,11.94 v132.77,11.94 82.17,11.94 v77.79,16.32 76.2,17.91 U$3.40 | v73.03,90.93 73.23,90.73 v132.77,90.73 181.18,90.73 U$2.40 | v39.37,91.06 28.19,91.06 11.37,74.23 11.37,64.58 12,63.94 15.57,63.94 17.73,61.79 SWITCH_CONNECTOR.6
  Top 0.508: U$5.P$4 11.21,20.7 R12.2
  Bottom 0.254: v132.77,90.73 v132.77,11.94 | U$4.40 v194.69,11.94 | U$1.40 v73.03,90.93 | v77.79,16.32 52.77,16.32 51.69,15.24 18.8,15.24 13.34,20.7 U$5.P$4
  Bottom 0.305: v73.03,90.93 72.9,91.06 v39.37,91.06
SWITCH_4  (via drill 0.35)
  Top 0.254: v76.2,91.44 76.28,91.52 v118.47,91.52 182.93,91.52 U$2.41 | v191.57,11.23 191.52,11.23 191.49,11.25 119.02,11.25 v119,11.28 80.16,11.28 v74.42,17.02 73.66,17.78 U$3.41 | 42.41,91.61 23.65,72.86 23.65,69.94 19.69,65.98 SWITCH_CONNECTOR.7
  Top 0.305: v76.2,91.44 76.03,91.61 42.41,91.61
  Top 0.508: U$5.P$3 10.71,23.24 R13.2
  Bottom 0.254: v118.47,91.52 130.02,79.96 130.02,22.22 119.08,11.28 v119,11.28 | U$4.41 200.66,20.32 v191.57,11.23 | v76.2,91.44 66.17,81.41 U$1.41 | v74.42,17.02 52.45,17.02 51.31,15.88 19.18,15.88 11.81,23.24 U$5.P$3
SWITCH_5  (via drill 0.35)
  Top 0.254: v188.14,10.57 188.09,10.62 v116.59,10.62 78.41,10.62 v71.12,17.91 U$3.42 | v79.5,92.2 79.53,92.23 v116.33,92.23 184.76,92.23 U$2.42
  Top 0.508: U$5.P$2 10.07,25.78 R14.2
  Bottom 0.254: v116.33,92.23 127.38,81.18 127.38,21.41 v116.59,10.62 | U$4.42 198.02,20.45 v188.14,10.57 | v79.5,92.2 68.71,81.41 U$1.42 | v71.12,17.91 70.99,17.78 52.2,17.78 50.93,16.51 19.68,16.51 10.41,25.78 U$5.P$2
  Bottom 0.305: v79.5,92.2 36.45,92.2 20.95,76.71 20.95,71.77 SWITCH_CONNECTOR.8

### Text on the board
tPlace: SPARE_2 | PWM_8 | 3.3V / ON/OFF | PWM_7 | 5V / ON/OFF | PWM_6 | 12V / ON/OFF | PWM_5 | ACOUSTIC / ON/OFF | PWM_4 | PWM_3 | MOBO / ON/OFF | PWM_2 | CONTROL / SIGNAL | PWM_1 | PLTA / ON/OFF | GND | SPARE_7 | SWITCH5 | SWITCH4 | SWITCH3 | SWITCH2 | SWITCH1 | KILL / SWITCH | SPARE_6 | SPARE_5 | GND | 5V | 3.3V | SPARE_4 | SPARE_3 | BACKPLANE / SDA | BACKPLANE / SCL | ROBOT_SDA | ROBOT_SCL
tNames: JETSON / ON/OFF